# EAGLE design MySens-GWeasySensRS485-V01-060 (EAGLE 7.6.0)
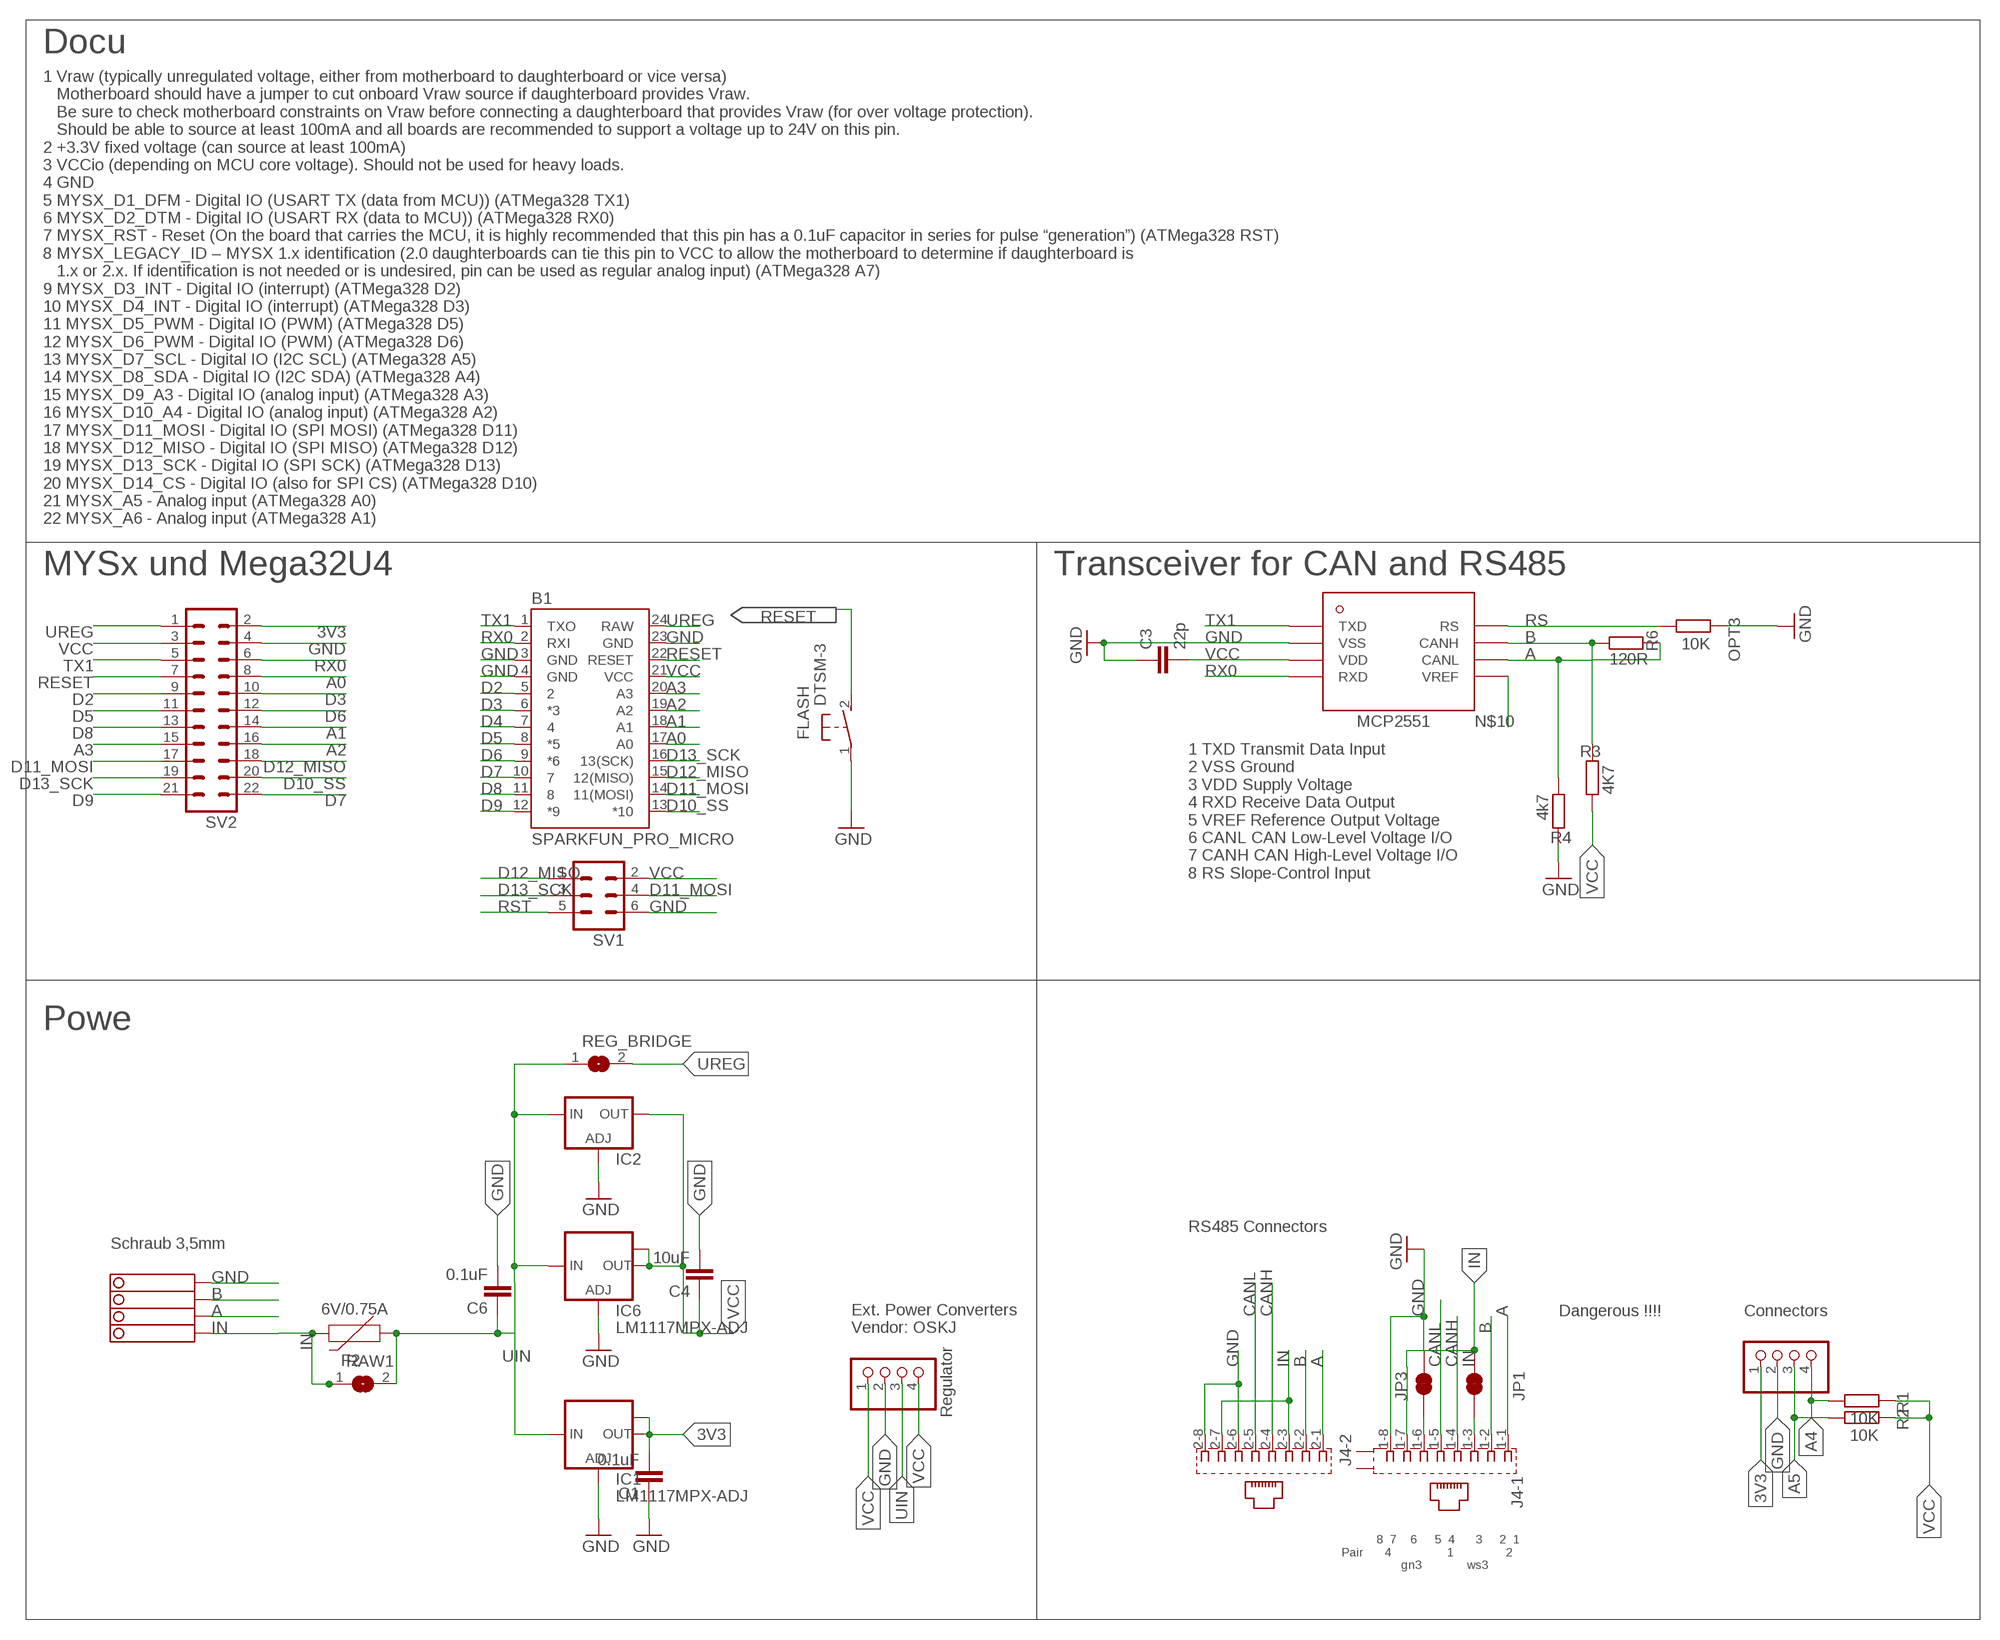
[diagram p0: schematic, sheet 1]

## Parts
B1  SPARKFUN_PRO_MICRO  [SPARKFUN_PRO_MICRO]
C1  0.1uF  C-EUC1206  [C1206]
C3  22p  C-EUC0805  [C0805]
C4  10uF  C-EUC1210  [C1210]
C6  0.1uF  C-EUC1206  [C1206]
F2  6V/0.75A  PPTC_THREE-QUARTER-AMP  [1206]
FLASH  DTSM-3  [DTSM-3]
I2C  PINHD-1X04_2.54-S  [1X04-S]
IC1  LM1117MPX-ADJ  [SOT223]
IC2  LD117ADT50TR  [DPACK]
IC6  LM1117MPX-ADJ  [SOT223]
J4  RJ45_2X_S  [RJ45_2X_S]
JP1  JUMPER-SMT_2_NC_TRACE_SILK  [SMT-JUMPER_2_NC_TRACE_SILK]
JP3  JUMPER-SMT_2_NC_TRACE_SILK  [SMT-JUMPER_2_NC_TRACE_SILK]
OPT3  10K  R-EU_R0805  [R0805]
R1  10K  R-EU_R0805  [R0805]
R2  10K  R-EU_R0805  [R0805]
R3  4K7  R-EU_R0805  [R0805]
R4  4k7  R-EU_R0805  [R0805]
R6  120R  R-EU_R0805  [R0805]
RAW1  SJ  [SJ]
REG_BRIDGE  SJ  [SJ]
STEPDWN  PINHD-1X04_2.54-S  [1X04-S]
SV1  MA03-2  [MA03-2]
SV2  MA11-2  [MA11-2]
U$1  MCP2551  [SOIC-8]
X4  1751264  [1751264]

## Nets
1: J4.1-3 JP1.1
2: J4.1-6 JP3.1
3V3: C1.2 I2C.1 IC1.2(OUT) IC1.TAB(OUT1) SV2.2
A: J4.1-1 J4.2-1 R4.1 R6.2 U$1.CANL X4.2
A0: B1.17(A0) SV2.8
A1: B1.18(A1) SV2.14
A2: B1.19(A2) SV2.16
A3: B1.20(A3) SV2.15
A4: I2C.4 R1.2
A5: I2C.3 R2.2
B: J4.1-2 J4.2-2 R3.2 R6.1 U$1.CANH X4.3
CANH: J4.1-4 J4.2-4
CANL: J4.1-5 J4.2-5
D2: B1.5 SV2.9
D3: B1.6(*3) SV2.10
D4: B1.7
D5: B1.8(*5) SV2.11
D6: B1.9(*6) SV2.12
D7: B1.10 SV2.22
D8: B1.11 SV2.13
D9: B1.12(*9) SV2.21
D10_SS: B1.13(*10) SV2.20
D11_MOSI: B1.14(11(MOSI)) SV1.4 SV2.17
D12_MISO: B1.15(12(MISO)) SV1.1 SV2.18
D13_SCK: B1.16(13(SCK)) SV1.3 SV2.19
GND [Power]: B1.3(GND) B1.4(GND) B1.23(GND) C1.1 C3.1 C4.2 C6.2 FLASH.1 I2C.2 IC1.1(ADJ) IC2.1(ADJ) IC6.1(ADJ) J4.1-8 J4.2-6 J4.2-8 JP3.2 OPT3.1 R4.2 STEPDWN.2 SV1.6 SV2.4 U$1.VSS X4.4
IN [Power]: F2.2 J4.1-7 J4.2-3 J4.2-7 JP1.2 RAW1.1 X4.1
N$10: U$1.VREF
RESET: B1.22(RESET) FLASH.2 SV2.7
RS: OPT3.2 U$1.RS
RST: SV1.5
RX0: B1.2(RXI) SV2.6 U$1.RXD
TX1: B1.1(TXO) SV2.5 U$1.TXD
UIN [Power]: C6.1 F2.1 IC1.3(IN) IC2.3(IN) IC6.3(IN) RAW1.2 REG_BRIDGE.1 STEPDWN.3
UREG [Power]: B1.24(RAW) REG_BRIDGE.2 SV2.1
VCC [Power]: B1.21(VCC) C3.2 C4.1 IC2.4(OUT) IC6.2(OUT) IC6.TAB(OUT1) R1.1 R2.1 R3.1 STEPDWN.1 STEPDWN.4 SV1.2 SV2.3 U$1.VDD
Unconnected: J4.G1(-1:S2) J4.G3(-1:S1)

## Notes on the sheet
- Docu
- 1 Vraw (typically unregulated voltage, either from motherboard to daughterboard or vice versa)
     Motherboard should have a jumper to cut onboard Vraw source if daughterboard provides Vraw. 
     Be sure to check motherboard constraints on Vraw before connecting a daughterboard that provides Vraw (for over voltage protection). 
     Should be able to source at least 100mA and all boards are recommended to support a voltage up to 24V on this pin.
  2 +3.3V fixed voltage (can source at least 100mA)
  3 VCCio (depending on MCU core voltage). Should not be used for heavy loads.
  4 GND
  5 MYSX_D1_DFM - Digital IO (USART TX (data from MCU)) (ATMega328 TX1)
  6 MYSX_D2_DTM - Digital IO (USART RX (data to MCU)) (ATMega328 RX0)
  7 MYSX_RST - Reset (On the board that carries the MCU, it is highly recommended that this pin has a 0.1uF capacitor in series for pulse “generation”) (ATMega328 RST)
  8 MYSX_LEGACY_ID – MYSX 1.x identification (2.0 daughterboards can tie this pin to VCC to allow the motherboard to determine if daughterboard is 
     1.x or 2.x. If identification is not needed or is undesired, pin can be used as regular analog input) (ATMega328 A7)
  9 MYSX_D3_INT - Digital IO (interrupt) (ATMega328 D2)
  10 MYSX_D4_INT - Digital IO (interrupt) (ATMega328 D3)
  11 MYSX_D5_PWM - Digital IO (PWM) (ATMega328 D5)
  12 MYSX_D6_PWM - Digital IO (PWM) (ATMega328 D6)
  13 MYSX_D7_SCL - Digital IO (I2C SCL) (ATMega328 A5)
  14 MYSX_D8_SDA - Digital IO (I2C SDA) (ATMega328 A4)
  15 MYSX_D9_A3 - Digital IO (analog input) (ATMega328 A3)
  16 MYSX_D10_A4 - Digital IO (analog input) (ATMega328 A2)
  17 MYSX_D11_MOSI - Digital IO (SPI MOSI) (ATMega328 D11)
  18 MYSX_D12_MISO - Digital IO (SPI MISO) (ATMega328 D12)
  19 MYSX_D13_SCK - Digital IO (SPI SCK) (ATMega328 D13)
  20 MYSX_D14_CS - Digital IO (also for SPI CS) (ATMega328 D10)
  21 MYSX_A5 - Analog input (ATMega328 A0)
  22 MYSX_A6 - Analog input (ATMega328 A1)
- MYSx und Mega32U4 | Transceiver for CAN and RS485
- 1 TXD Transmit Data Input 
  2 VSS Ground 
  3 VDD Supply Voltage 
  4 RXD Receive Data Output 
  5 VREF Reference Output Voltage 
  6 CANL CAN Low-Level Voltage I/O 
  7 CANH CAN High-Level Voltage I/O 
  8 RS Slope-Control Input
- Powe
- RS485 Connectors
- Schraub 3,5mm
- Dangerous !!!! | Connectors
- Ext. Power Converters
  Vendor: OSKJ
- Regulator
- 8  7    6     5  4      3     2  1
  Pair      4                1               2
                   gn3             ws3

## Library data of the parts
B1 = SparkFun-Boards:SPARKFUN_PRO_MICRO: SparkFun Pro Micro Atmega32U4 compatible footprint. SparkFun Products: 3.3V/8MHz <https://www.sparkfun.com/products/12587> 5V/16MHz <https://www.sparkfun.com/products/12640>
C1 C3 C4 C6 = rcl:C-EU: CAPACITOR, European symbol
F2 = SparkFun-Fuses:PPTC: Resettable Fuse PPTC Resettable Fuse. Really a sort of resistor with a polymeric positive temperature coefficient whose resistance increases dramatically with an increase in temperature. When heated by the power passing through the resistance rises causing the current to be limited, protecting the circuit. This is achieved by the transition of the polymer from a crystalline to an amorphous state where the conductive carbon separates breaking the conductive pathways found in the cool crystalline structure. When a PPTC cools back down it resumes conducting letting the circuit turn back on. SparkFun Products: SparkFun RedBoard - Programmed with Arduino <https://www.sparkfun.com/products/12757> Pro Micro - 5V/16MHz <https://www.sparkfun.com/products/12640> Arduino Pro 328 - 5V/16MHz <https://www.sparkfun.com/products/10915> MP3 Trigger <https://www.sparkfun.com/products/13720>; PROD_ID: RES-11150
FLASH = mechanics:DTSM-3: Diptronics SMD button 6x3.5 mm
I2C STEPDWN = pinhead-2:PINHD-1X04: PIN HEADER
IC1 IC6 = lm1117:LM1117MPX-ADJ
IC2 = v-reg:LD117A?*: Low drop fixed and adjustable positive voltage regulators 1 A Source: http://www.st.com/stonline/products/literature/ds/7194/ld1117axx.pdf
J4 = RJ45:RJ45_2X_S: AMP connector
JP1 JP3 = SparkFun-Jumpers:JUMPER-SMT_2_NC_TRACE: Normally closed trace jumper This jumper has a trace between two pads so it's normally closed (NC). Use a razor knife to open the connection. For best results follow the IPC guidelines for cutting traces: Cutout at least 0.063 mm (0.005 in). Remove all loose material to clean up the cut area. Seal the cut with an approved epoxy. Reapply solder to reclose the connection.
OPT3 R1-R4 R6 = rcl:R-EU_: RESISTOR, European symbol
RAW1 REG_BRIDGE = jumper:SJ: SMD solder JUMPER
SV1 = con-lstb:MA03-2: PIN HEADER; OC_FARNELL: unknown; OC_NEWARK: unknown
SV2 = con-Pinheader:MA11-2: PIN HEADER; OC_FARNELL: unknown; OC_NEWARK: unknown
U$1 = MCP2551:MCP2551: The MCP2551 is a high-speed CAN, fault-tolerant device that serves as the interface between a CAN protocol controller and the physical bus. The MCP2551 provides differential transmit and receive capability for the CAN protocol controller and is fully compatible with the ISO-11898 standard, including 24V requirements. It will operate at speeds of up to 1 Mb/s. Typically, each node in a CAN system must have a device to convert the digital signals generated by a CAN controller to signals suitable for transmission over the bus cabling (differential output). It also provides a buffer between the CAN controller and the high-voltage spikes that can be generated on the CAN bus by outside sources (EMI, ESD, electrical transients, etc.).
X4 = con-phoenix-350:1751264: MKDS 1/ 4-3,5 Printklemme Nennstrom: 10 A Bemessungsspannung: 160 V Raster: 3,5 mm Polzahl: 4 Montageart: Löten Anschlussart: Schraubanschluss Anschlussrichtung vom Leiter zur Platine: 0° Source: http://eshop.phoenixcontact.com .. 1751264.pdf; MPN: 1751264; OC_FARNELL: unknown; OC_NEWARK: 10R0934

## Net classes
0 default: width 0.254 mm
1 Power: width 0.508 mm

## Board
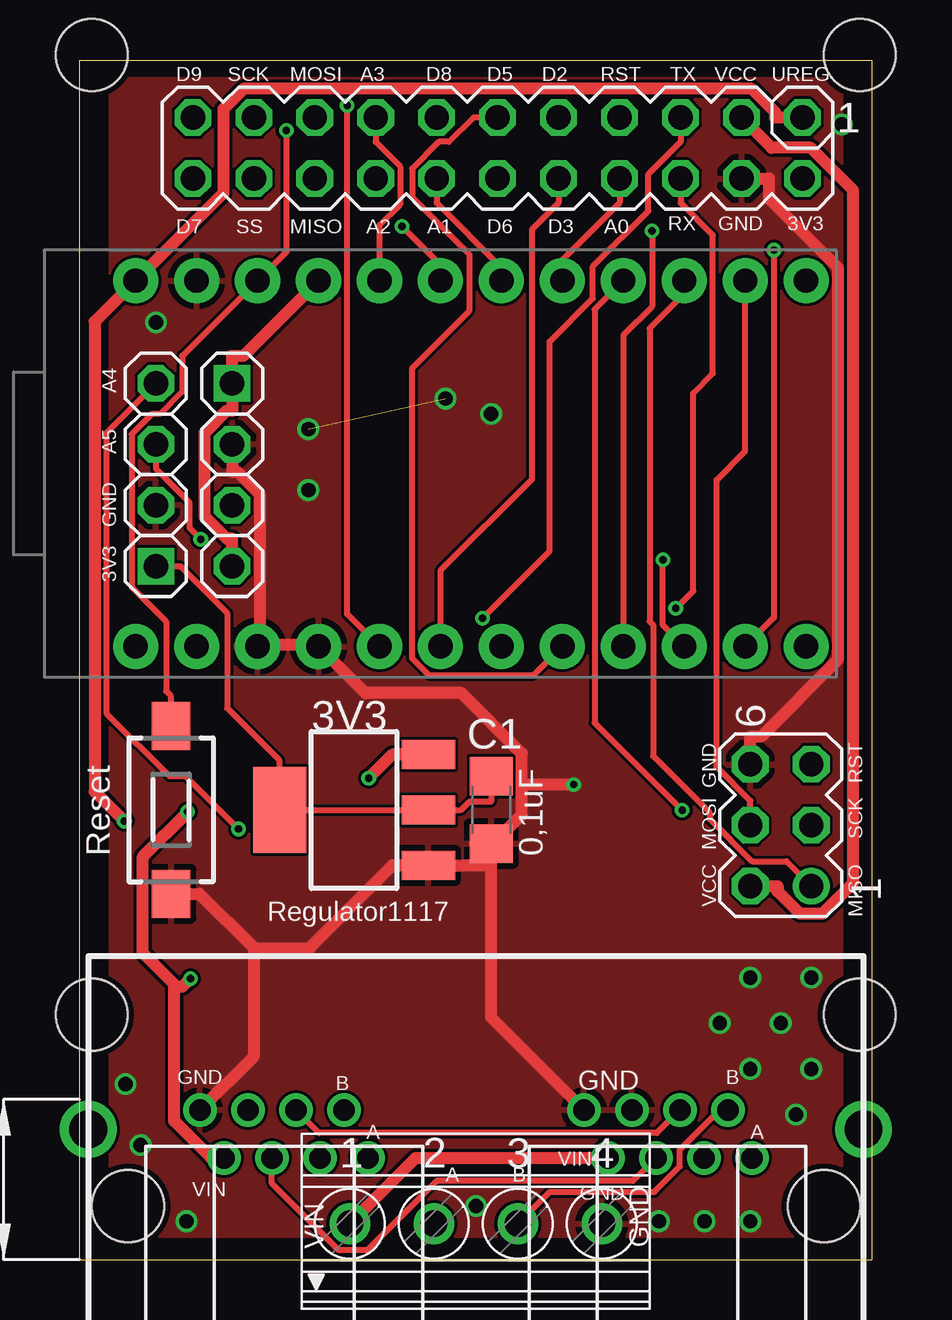
[diagram p1: board, top side]
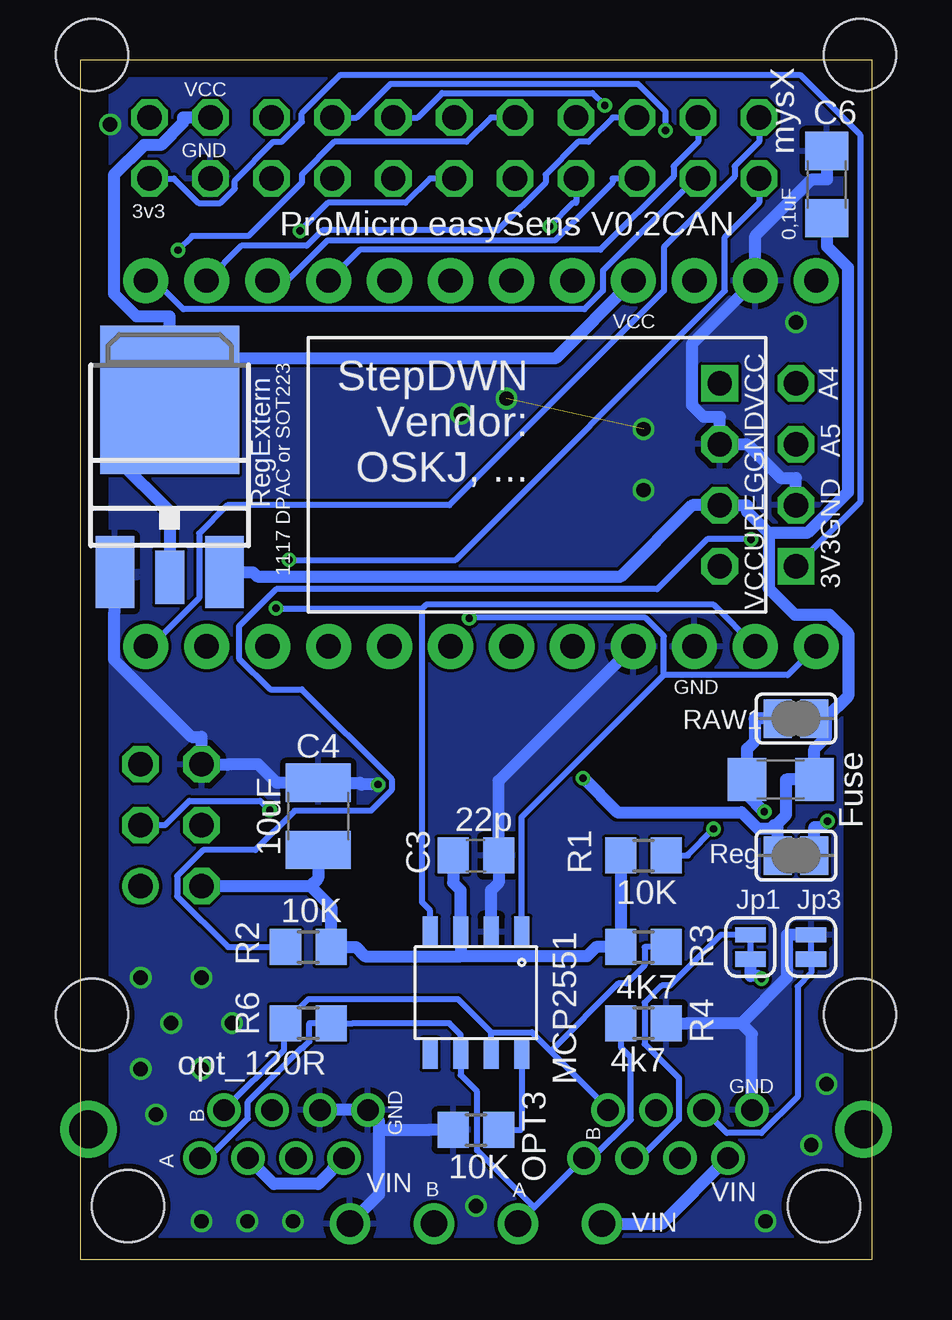
[diagram p2: board, bottom side, seen from below]

Size 33 x 50 mm. Coordinates in mm from the lower left corner, seen from the top.
Outline: 0,0 0,50 33,50 33,0 0,0
Copper layers (1*16): Top 0.035mm / dielectric 1.5mm / Bottom 0.035mm
Design rules "dirt_cheap_dirty_boards.v1": minimum track width 5mil, minimum drill 12mil, track to track 5mil, track to pad 5mil, pad to pad 5mil, via to via 5mil, smd to smd 0mil, copper to edge 10mil, drill to drill 10mil, minimum pad ring 10mil, minimum via ring 6mil, stop-mask expansion 2mil, vias tented up to drill 25mil, thermal gap 10mil
Holes 3 mm at 32.5,50.2 0.5,50.2 32.5,10.2 0.5,10.2
tRestrict: area 0,50 to 33,50.5; area 32.8,11.9 to 33.3,44.9
bRestrict: area 0,50 to 33,50.5; area 32.8,12 to 33.3,45

### Footprints (pad centres in the part's own frame; a part is rotated, then mirrored left to right if it is on the bottom)
SPARKFUN_PRO_MICRO = drill 1.016 pad 1.88: 1 -7.62,12.7; 2 -7.62,10.16; 3 -7.62,7.62; 4 -7.62,5.08; 5 -7.62,2.54; 6 -7.62,0; 7 -7.62,-2.54; 8 -7.62,-5.08; 9 -7.62,-7.62; 10 -7.62,-10.16; 11 -7.62,-12.7; 12 -7.62,-15.24; 13 7.62,-15.24; 14 7.62,-12.7; 15 7.62,-10.16; 16 7.62,-7.62; 17 7.62,-5.08; 18 7.62,-2.54; 19 7.62,0; 20 7.62,2.54; 21 7.62,5.08; 22 7.62,7.62; 23 7.62,10.16; 24 7.62,12.7
C1206 = smd 1.6 x 1.8: 1 -1.4,0; 2 1.4,0
C0805 = smd 1.3 x 1.5: 1 -0.95,0; 2 0.95,0
C1210 = smd 1.6 x 2.7: 1 -1.4,0; 2 1.4,0
1206 = smd 1.6 x 1.8: 1 -1.4,0; 2 1.4,0
DTSM-3 = smd 2 x 1.6: 1 -3.494,0; 2 3.494,0
1X04-S = drill 1.016 square: 1 -3.81,0 | drill 1.016 octagon: 2 -1.27,0; 3 1.27,0; 4 3.81,0
SOT223 = smd 1.219 x 2.235: 1 -2.311,-3.099; 2 0,-3.099; 3 2.311,-3.099 | smd 3.6 x 2.2: TAB 0,3.099
DPACK = smd 1.6 x 3: 1 -2.28,-4.8; 3 2.28,-4.8 | smd 5.8 x 6.2: 4 0,2.38
RJ45_2X_S = drill 0.889: 1-1 -4.5,2; 1-2 -5.5,4; 1-3 -6.5,2; 1-4 -7.5,4; 1-5 -8.5,2; 1-6 -9.5,4; 1-7 -10.5,2; 1-8 -11.5,4; 2-1 11.5,2; 2-2 10.5,4; 2-3 9.5,2; 2-4 8.5,4; 2-5 7.5,2; 2-6 6.5,4; 2-7 5.5,2; 2-8 4.5,4 | drill 1.575 pad 2.184: G1 -16.15,3.2; G3 16.15,3.2 | hole 3: -14.5,0; 14.5,0
SMT-JUMPER_2_NC_TRACE_SILK = smd 0.635 x 1.27: 1 -0.508,0; 2 0.508,0
R0805 = smd 1.3 x 1.5: 1 -0.95,0; 2 0.95,0
SJ = smd 1.168 x 1.6: 1 -0.762,0; 2 0.762,0
MA03-2 = drill 1.016: 1 -2.54,-1.27 | drill 1.016 octagon: 2 -2.54,1.27; 3 0,-1.27; 4 0,1.27; 5 2.54,-1.27; 6 2.54,1.27
MA11-2 = drill 1.016 octagon: 1 -12.7,-1.27; 2 -12.7,1.27; 3 -10.16,-1.27; 4 -10.16,1.27; 5 -7.62,-1.27; 6 -7.62,1.27; 7 -5.08,-1.27; 8 -5.08,1.27; 9 -2.54,-1.27; 10 -2.54,1.27; 11 0,-1.27; 12 0,1.27; 13 2.54,-1.27; 14 2.54,1.27; 15 5.08,-1.27; 16 5.08,1.27; 17 7.62,-1.27; 18 7.62,1.27; 19 10.16,-1.27; 20 10.16,1.27; 21 12.7,-1.27; 22 12.7,1.27
SOIC-8 = smd 1.27 x 0.635: CANH 2.54,0.635; CANL 2.54,-0.635; RS 2.54,1.905; RXD -2.54,-1.905; TXD -2.54,1.905; VDD -2.54,-0.635; VREF 2.54,-1.905; VSS -2.54,0.635
1751264 = drill 1.1 pad 1.7: 1 -5.25,-0.1; 2 -1.75,-0.1; 3 1.75,-0.1; 4 5.25,-0.1

### Placement (x,y rotation side)
B1  15.03,33.18 90 top
C1  17.14,18.74 90 top
C3  16.51,16.84 180 bottom
C4  23.08,18.48 90 bottom
C6  1.89,44.81 90 bottom
F2  3.81,20.01 180 bottom
FLASH  3.81,18.74 90 top
I2C  3.17,32.71 90 top
IC1  11.43,18.74 90 top
IC2  29.27,33.46 0 bottom
IC6  29.27,31.54 0 bottom
J4  16.51,2.23 0 top
JP1  5.08,13.03 270 bottom
JP3  2.54,13.03 90 bottom
OPT3  16.51,5.41 0 bottom
R1  9.53,16.84 0 bottom
R2  23.5,13.03 180 bottom
R3  9.53,13.03 0 bottom
R4  9.53,9.85 0 bottom
R6  23.5,9.85 0 bottom
RAW1  3.17,22.55 0 bottom
REG_BRIDGE  3.17,16.84 0 bottom
STEPDWN  6.35,32.71 270 top
SV1  29.21,18.11 90 top
SV2  17.41,46.33 180 top
U$1  16.51,11.12 270 bottom
X4  16.51,1.59 0 top

### Tracks (layer width: path | path; a pad name or v marks a point on that pad's centre or on a via)
1
  Bottom 0.254: JP1.1 6.3,13.53 8.41,11.42 8.76,11.42 9.48,10.71 9.48,8.99 8.06,7.57 8.06,5.83 9.66,4.23 J4.1-3
2
  Bottom 0.254: JP3.1 2.54,11.95 3.11,11.37 3.11,6.78 4.62,5.27 6.05,5.27 J4.1-6
3V3
  Top 0.254: 8.33,19.22 8.81,18.74 IC1.2 15.9,18.74 16.25,19.09 17.14,19.09 C1.2 | 8.33,19.22 8.33,20.79 6.14,22.98 6.14,26.95 4.19,28.9 I2C.1 | IC1.TAB 8.33,19.22
  Bottom 0.254: SV2.2 29.1,45.06 28.08,44.04 27.16,44.04 26.56,44.64 26.56,44.98 24.95,46.58 24.61,46.58 23.77,47.43 23.77,47.77 22.15,49.38 3,49.38 0.5,46.88 0.5,31.58 I2C.1
A
  Bottom 0.254: 14.09,2.17 12.03,4.23 J4.1-1 11.66,4.23 10.06,5.83 10.06,8.43 10.47,8.85 R4.1 | X4.2 14.09,2.17 | 14.09,2.17 16.46,4.55 16.46,7.01 17.14,7.69 U$1.CANL 17.14,9.37 17.62,9.85 21.64,9.85 R6.2 23.45,9.85 23.45,9.09 23.72,8.82 23.77,8.82 26.01,6.58 26.01,5.88 27.66,4.23 J4.2-1
A0
  Top 0.254: SV2.8 22.5,44.04 20.11,41.66 B1.17
A1
  Top 0.254: SV2.14 14.88,44.04 17.57,41.35 B1.18
A2  (via drill 0.3 pad 0.61)
  Top 0.254: v13.43,43.06 15.03,41.46 B1.19
  Bottom 0.254: v13.43,43.06 12.45,44.04 12.34,44.04 SV2.16
A3
  Top 0.254: B1.20 12.49,43.12 13.35,43.98 13.35,45.57 12.34,46.58 SV2.15
A4  (via drill 0.3 pad 0.61)
  Top 0.254: v6.61,17.95 4.43,20.14 3.75,20.14 1.13,22.75 1.13,34.48 I2C.4
  Bottom 0.254: R1.2 7.67,16.84 7.67,16.89 v6.61,17.95
A5  (via drill 0.3 pad 0.61)
  Top 0.254: v5.05,30.02 4.58,30.49 4.58,31.56 3.17,32.96 I2C.3
  Bottom 0.254: v5.05,30.02 6.88,30.02 8.96,27.94 24.83,27.94 26.39,26.39 26.39,25.06 25.09,23.76 23.76,23.76 20.02,20.03 20.02,19.57 20.89,18.7 24.07,18.7 25.7,17.07 27.88,17.07 28.96,15.99 28.96,15.14 26.84,13.03 R2.2
B
  Top 0.254: X4.3 19.59,2.82 23.95,2.82 25.01,3.88 25.01,4.58 26.66,6.23 J4.2-2
  Bottom 0.254: J4.2-2 24.5,8.74 24.5,9.85 | 13.4,8.69 11.01,6.3 J4.1-2 | 15.88,9.47 14.18,9.47 13.4,8.69 | 13.4,8.69 10.58,11.51 10.23,11.51 9.48,12.26 9.48,13.03 R3.2 | 15.88,9.47 15.88,9.37 U$1.CANH | 24.5,9.85 23.49,10.86 17.26,10.86 15.88,9.47 | R6.1 24.5,9.85
CANH
  Top 0.254: J4.2-4 24.05,5.27 9.97,5.27 J4.1-4
CANL
  Top 0.254: J4.2-5 23.06,3.28 14.87,3.28 11.98,0.39 10.8,0.39 8.01,3.18 J4.1-5
D2  (via drill 0.3 pad 0.61)
  Top 0.254: B1.5 11.14,26.91 v11.14,48.11
  Bottom 0.254: v11.14,48.11 11.65,48.62 17.92,48.62 18.94,47.6 SV2.9
D3
  Top 0.254: SV2.10 19.95,44.04 18.84,42.93 18.84,32.52 15.03,28.71 B1.6
D5
  Top 0.254: SV2.11 16.4,47.6 15.38,46.58 14.96,46.58 13.85,45.48 13.85,44.29 16.23,41.91 16.23,39.53 13.84,37.14 13.84,25.06 14.53,24.37 18.92,24.37 B1.8
D6  (via drill 0.3 pad 0.61)
  Top 0.254: v23.85,42.87 23.85,39.73 22.65,38.53 B1.9
  Bottom 0.254: SV2.12 18.43,45.06 19.45,44.04 22.68,44.04 v23.85,42.87
D7  (via drill 0.3 pad 0.61)
  Top 0.254: v24.3,29.16 24.27,29.13 24.27,26.48 B1.10
  Bottom 0.254: SV2.22 4.71,44.04 6.14,42.62 6.14,40.38 17.35,29.16 v24.3,29.16
D8  (via drill 0.3 pad 0.61)
  Top 0.254: v28.93,42.07 28.93,26.76 B1.11
  Bottom 0.254: v28.93,42.07 28.34,42.66 26,42.66 23.77,44.89 23.77,45.23 22.41,46.58 16.91,46.58 15.89,47.6 SV2.13
D9
  Bottom 0.254: SV2.21 4.71,46.58 5.73,45.57 5.73,45.14 8.68,42.19 8.68,40.38 17.61,31.45 26.87,31.45 28.05,30.27 28.05,27.57 30.05,25.56 B1.12
D10_SS
  Bottom 0.254: SV2.20 7.38,45.06 11.22,41.22 11.22,40.38 11.99,39.61 28.7,39.61 29.9,40.8 B1.13
D11_MOSI
  Top 0.254: B1.14 27.73,33.69 26.54,32.5 26.54,20.52 27.94,19.12 SV1.4
  Bottom 0.254: B1.14 26.28,42.25 23.56,42.25 22.91,42.9 15.59,42.9 13.61,44.88 13.61,45.22 12.25,46.58 11.83,46.58 10.81,47.6 SV2.17
D12_MISO
  Top 0.254: B1.15 25.19,40.26 23.74,38.81 23.74,26.6 23.89,26.45 23.89,20.99 26.24,18.63 26.24,18.36 28,16.6 29.45,16.6 SV1.1
  Bottom 0.254: B1.15 24.37,40.8 22.7,42.47 13.23,42.47 10.81,44.89 10.81,45.06 SV2.18
D13_SCK  (via drill 0.3 pad 0.61)
  Top 0.254: B1.16 21.45,39.6 21.45,22.37 v25.1,18.73
  Bottom 0.254: v25.1,18.73 25.5,19.12 28.45,19.12 29.46,18.11 SV1.3 | SV2.19 7.25,46.58 8.27,45.57 8.27,45.14 11.33,42.09 21.36,42.09 B1.16
GND  (via drill 0.3 pad 0.61, 0.6)  (1 unrouted)
  Top 0.508: 17.14,16.43 17.14,17.25 | J4.2-8 17.14,10.09 17.14,16.43 | 17.14,16.43 16.03,16.43 IC1.1 13.03,16.43 9.57,12.97 7.27,12.97 | 18.43,19.8 18.43,21.1 15.92,23.61 11.9,23.61 B1.4 9.87,25.64 7.49,25.64 | 17.14,17.25 18.43,18.53 18.43,19.8 | 18.43,19.8 v20.59,19.8 | C1.1 17.14,17.25 | 7.49,25.64 B1.3 | 7.49,25.64 7.49,31.92 6.57,32.84 6.35,32.84 STEPDWN.2 | 7.27,12.97 4.99,15.25 FLASH.1 | J4.1-8 7.27,8.49 7.27,12.97 | SV1.6 27.94,21.79 28.37,21.79 31.59,25.01 31.59,41.34 28.72,44.22 28.72,45.06 SV2.4
  Bottom 0.508: v20.59,19.8 21.27,19.8 21.35,19.88 C4.2 23.59,19.88 24.81,19.88 25.58,20.64 26.8,20.64 SV1.6 27.94,21.79 28.37,21.79 31.59,25.01 31.59,26.93 31.58,26.94 IC6.1 31.55,28.47 IC2.1 | C6.2 1.89,45.02 2.52,45.02 4.87,42.67 B1.23 7.5,38.17 7.5,35.6 7.02,35.12 6.35,35.12 STEPDWN.2 5.21,33.98 3.81,32.58 3.17,32.58 I2C.2 | 5.46,9.85 7.71,9.85 R4.2 | 5.46,9.85 3.56,11.76 3.56,13.53 JP3.2 | J4.1-8 5.01,9.4 5.46,9.85 | U$1.VSS 15.88,15.39 15.56,15.7 C3.1 15.56,17.97 15.56,19.95 B1.4 | 20.54,5.41 20.54,5.76 J4.2-8 J4.2-6 | X4.4 20.54,2.71 20.54,5.41 | 20.54,5.41 18.49,5.41 OPT3.1
  other vias: 2.54,4.77 1.91,7.31 4.45,1.59 16.51,2.23 24.13,1.59 26.04,1.59 27.94,1.59 29.84,6.04 30.48,7.95 30.48,11.76 27.94,11.76 26.67,9.85 27.94,7.95 29.21,9.85 17.14,35.25 15.24,35.88 9.53,32.08 9.53,34.61 3.17,39.06 31.75,47.31
  pour Bottom: 1.27,49.22 31.75,49.22 31.75,0.96 1.27,0.96
  pour Top: 1.27,0.96 1.27,49.22 31.75,49.22 31.75,0.96
IN  (via drill 0.3 pad 0.61)
  Top 0.508: 4.03,11.38 4.29,11.38 v4.61,11.71 | 4.03,11.38 2.63,12.78 2.63,16.8 v4.49,18.66 | J4.1-7 5.48,4.23 3.93,5.78 3.93,11.29 4.03,11.38 | X4.1 13.99,4.23 J4.2-7
  Bottom 0.508: J4.2-7 23.09,3.15 24.93,3.15 J4.2-3 | JP1.2 5.08,11.82 4.73,11.82 v4.61,11.71 | v4.49,18.66 5.21,19.38 F2.2 5.21,21.29 4.9,21.6 4.9,22.55 RAW1.1 | X4.1 8.74,1.5 J4.1-7
RESET  (via drill 0.3 pad 0.61)
  Top 0.254: FLASH.2 3.81,23.49 3.6,23.7 3.6,26.59 2.16,28.03 2.16,34.4 3,35.25 3.35,35.25 4.27,36.17 4.27,37.66 B1.22 8.61,42 v8.61,47.07
  Bottom 0.254: v8.61,47.07 8.61,47.85 9.76,49 20.08,49 21.48,47.6 SV2.7
RS
  Bottom 0.254: OPT3.2 14.66,5.41 14.61,5.46 U$1.RS
RX0  (via drill 0.3 pad 0.61)
  Top 0.254: v24.84,27.14 25.57,27.87 25.57,36.12 26.39,36.94 26.39,42.69 25.04,44.04 SV2.6
  Bottom 0.254: 18.77,27.11 18.77,14.9 18.41,14.55 U$1.RXD | B1.2 6.6,27.29 18.58,27.29 18.77,27.11 | 18.77,27.11 24.81,27.11 v24.84,27.14
TX1  (via drill 0.3 pad 0.61)
  Top 0.254: v16.79,26.73 19.58,29.52 19.58,38.27 21.38,40.07 21.38,41.4 23.69,43.71 23.69,45.24 25.04,46.58 SV2.5
  Bottom 0.254: 8.68,24.36 8.68,25.98 9.45,26.75 16.77,26.75 v16.79,26.73 | 8.68,24.36 14.61,18.44 14.61,14.55 U$1.TXD | B1.1 3.53,24.36 8.68,24.36
UIN  (via drill 0.3 pad 0.61)
  Top 0.508: v12.05,20.07 13.03,21.05 IC1.3
  Bottom 0.508: 4.32,30.29 5.21,31.17 5.21,31.44 STEPDWN.3 6.92,31.44 7.49,31.44 10.46,28.48 25.63,28.48 25.81,28.66 IC2.3 26.99,28.47 IC6.3 | 4.32,30.29 2.71,30.29 1.01,31.99 1.01,41.36 1.88,42.23 1.89,42.23 C6.1 | 4.32,30.29 4.32,27.97 3.23,26.88 1.78,26.88 1.01,26.11 1.01,23.47 1.93,22.55 | v12.05,20.07 10.62,18.64 5.44,18.64 4.78,17.98 4.21,17.98 4.08,18.1 4.02,18.1 | 4.02,18.1 3.59,18.54 3.59,20.01 F2.1 2.41,21.29 1.93,21.77 1.93,22.55 | 4.02,18.1 3.94,18.02 REG_BRIDGE.1 | RAW1.2 1.93,22.55
UREG  (via drill 0.3 pad 0.61)
  Top 0.508: v1.86,18.28 0.62,19.51 0.62,39.09 B1.24 5.99,44.45 5.99,47.95 6.83,48.8 28,48.8 28.97,47.82 28.97,47.6 SV2.1
  Bottom 0.508: REG_BRIDGE.2 2.41,18.02 2.12,18.02 v1.86,18.28
VCC
  Top 0.508: SV1.2 29.08,15.56 29.08,15.34 30.01,14.42 30.95,14.42 32.23,15.7 32.23,44.56 30.45,46.34 28.83,46.34 SV2.3 | B1.21 6.81,37.66 6.35,37.66 STEPDWN.1 6.35,35.38 6.13,35.38 5.21,34.46 5.21,30.96 6.13,30.04 6.35,30.04 STEPDWN.4
  Bottom 0.508: R1.1 R3.1 11.51,13.03 11.89,12.64 17.14,12.64 | IC6.2 29.27,31.19 31.45,33.37 31.45,34.63 IC6.TAB IC2.4 29.27,37.58 | 23.41,15.56 22.55,14.7 22.55,14.16 R2.1 21.51,13.03 21.13,12.64 17.14,12.64 | C3.2 17.46,15.7 17.14,15.39 U$1.VDD 17.14,12.64 | 29.27,37.58 13.17,37.58 B1.21 | 23.41,15.56 23.08,15.89 C4.1 | SV1.2 23.41,15.56 | 29.27,37.58 29.27,39.32 30.66,39.32 31.6,40.25 31.6,45.2 30.34,46.46 29.64,46.46 28.72,47.38 28.72,47.6 SV2.3

### Text on the board
tNames: D9 | SCK | MOSI | A3 | D8 | D5 | D2 | RST | TX | VCC | UREG | D7 | SS | MISO | A2 | A1 | D6 | D3 | A0 | RX | GND | 3V3 | A4 | A5 | GND | 3V3 | 3V3 | C1 | GND | RST | MOSI | SCK | Reset | 0,1uF | VCC | MISO | Regulator1117 | GND | B | GND | B | A | A | VIN | VIN | A | B | GND | VIN | GND
bNames: VCC | C6 | mysX | GND | 3v3 | ProMicro easySens V0.2CAN | 0,1uF | VCC | VCC | StepDWN / Vendor: / OSKJ, ... | RegExtern | A4 | GND | A5 | GND | UREG | 3V3 | VCC | 1117 DPAC or SOT223 | GND | RAW1 | C4 | 22p | Fuse | Reg | R1 | C3 | 10uF | Jp3 | Jp1 | 10K | 10K | R3 | R2 | 4K7 | R4 | R6 | 4k7 | GND | opt_120R | GND | B | B | 10K | A | VIN | OPT3 | B | VIN | A | VIN
tValues: C6 | 0,1uF | JP-Fuse | C4 | Fuse | 0,1uF | 10K | R4 | R2 | C3 | Jp1 | 4K7 | Jp3 | R1 | 10K | 10K | 22p | R3 | R6 | RJ45 Connector | Opt.120R | 4K7 | OPT3